# Altium project EVK-NORA-W40.PrjPcb (part 1 of 4)
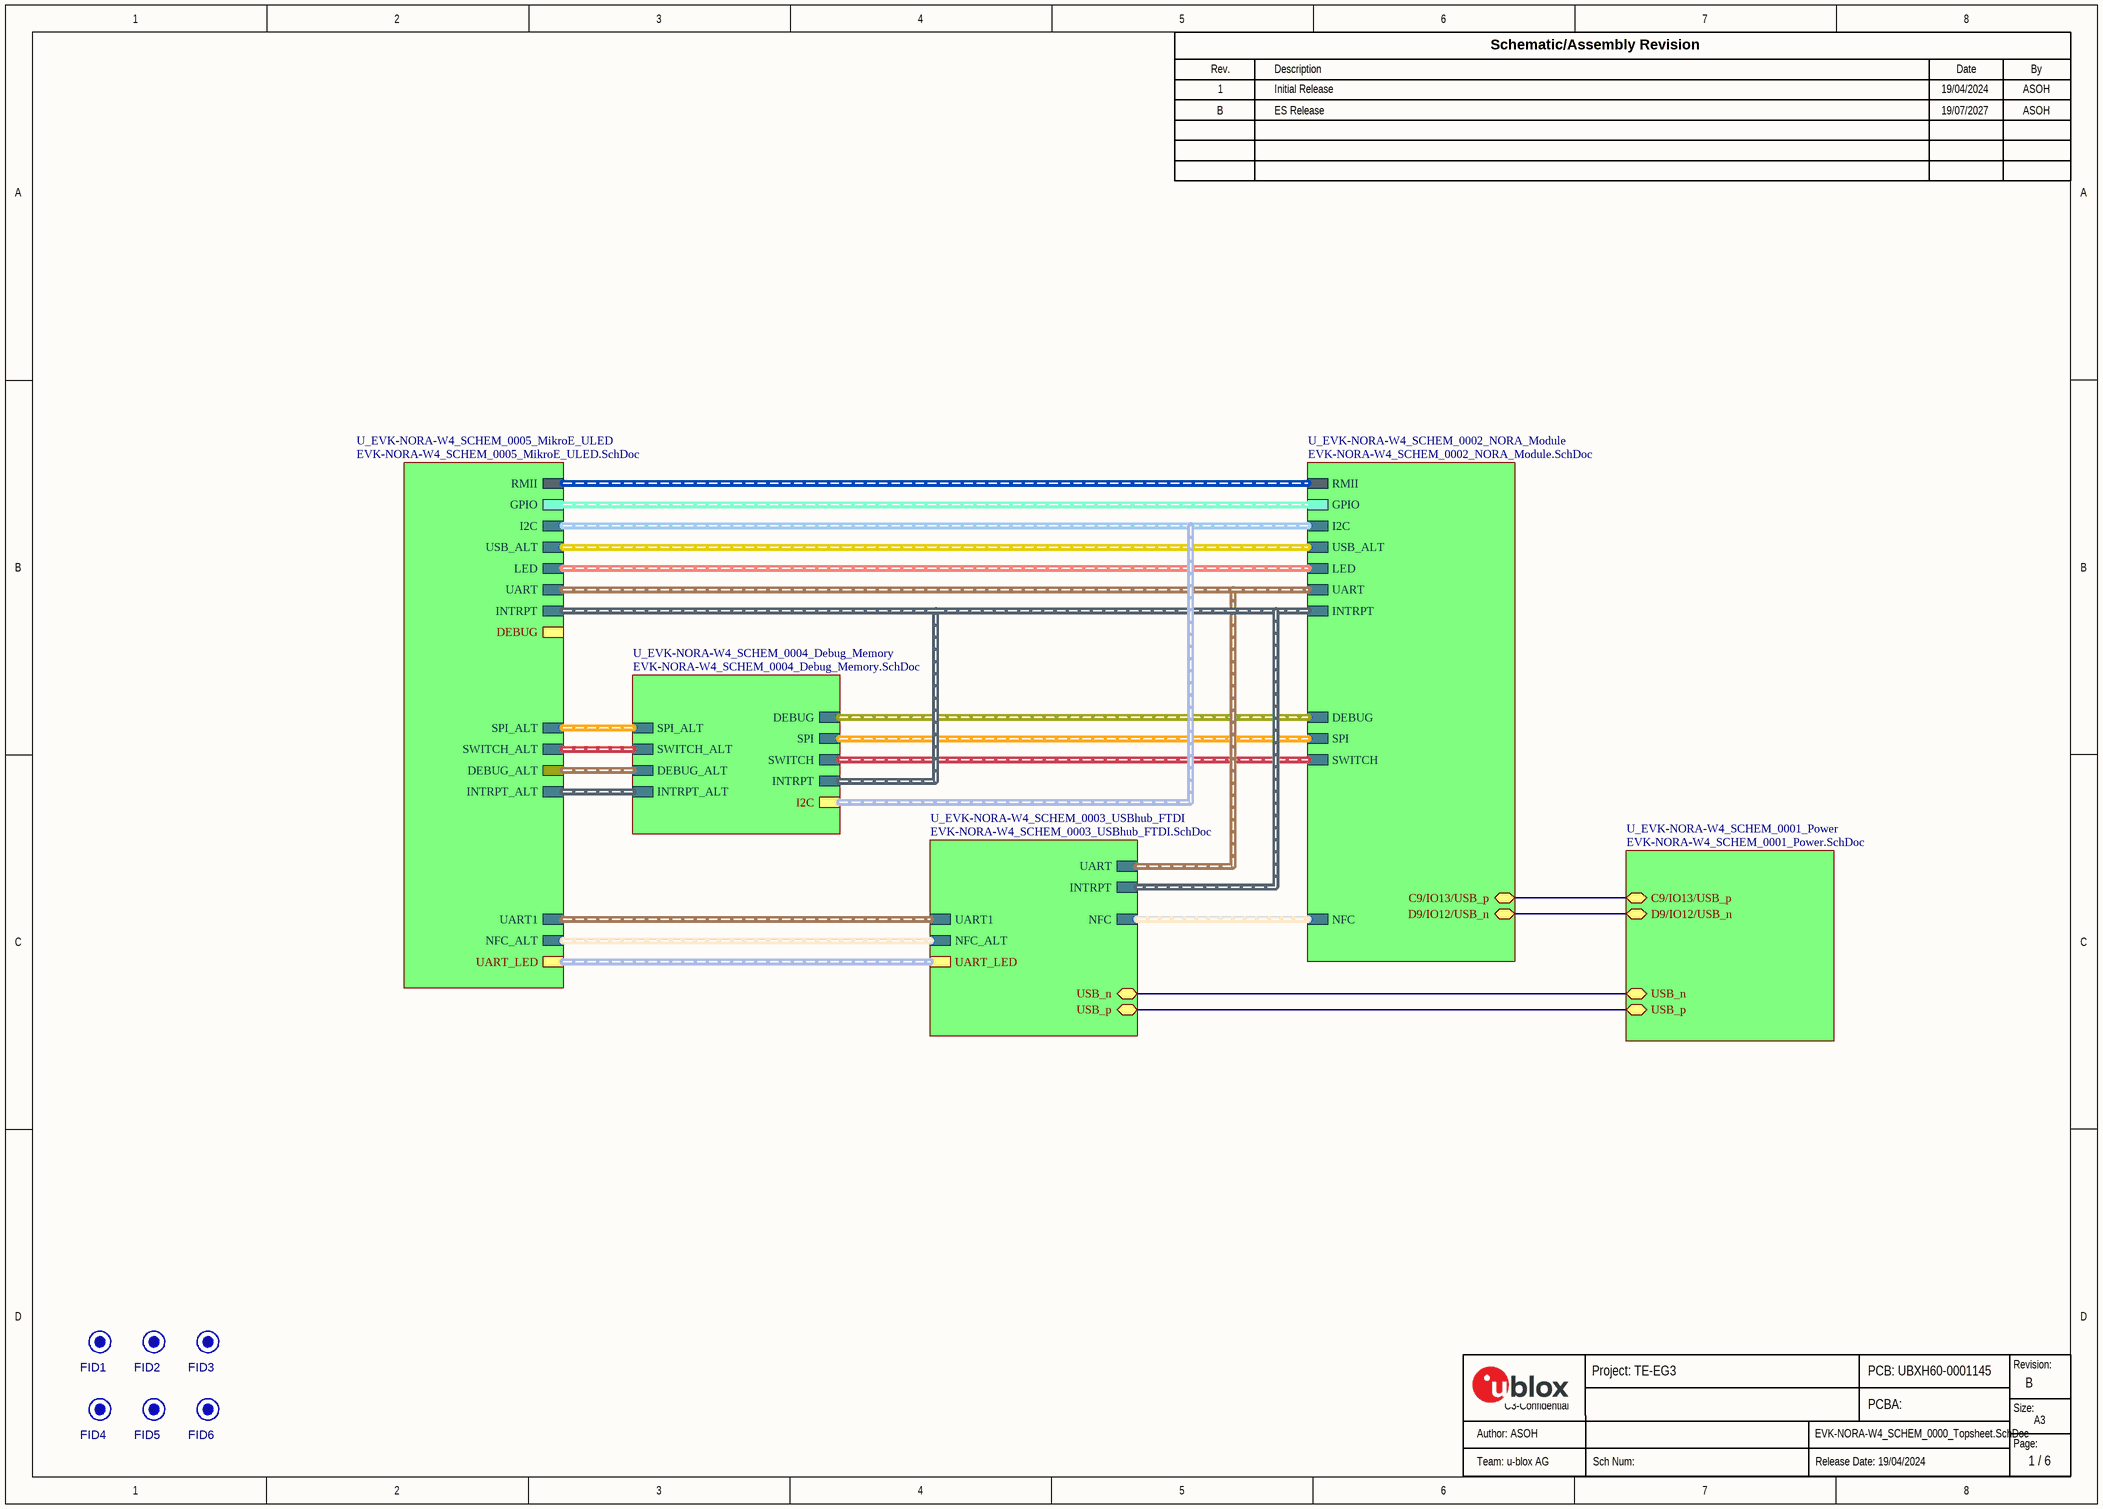
[diagram p0: EVK-NORA-W4_SCHEM_0000_Topsheet.SchDoc]
GlobalClientName: u-blox; GlobalProjectCode: TE_EG3; GlobalProjectLink: www.u-blox.com; GlobalProjectName: TE-EG3; GlobalProjectRevision: Rev B; GlobalProjectTeam: u-blox AG; GlobalReleaseDate: 04/19/2024; PCBConfidentialGrade: C1; PCBDocNum: UBXH60-0001145; PCBName: EVK-NORA-W40; PCBRevReleaseBy1: ASOH; PCBRevReleaseBy2: ASOH; PCBRevReleaseDate1: 04/19/2024; PCBRevReleaseDate2: 07/19/2024; PCBRevReleaseDesc1: Initial Release; PCBRevReleaseDesc2: ES Release; PCBRevReleaseRev1: A; PCBRevReleaseRev2: B; PCBUBXNum: UBXH60-0001145; ProjectEngineer: ASOH; ReleaseBy1: ASOH; ReleaseBy2: ASOH; ReleaseDate1: 04/19/2024; ReleaseDate2: 07/19/2024; ReleaseDesc1: Initial Release; ReleaseDesc2: ES Release; ReleaseRev1: Rev A; ReleaseRev2: Rev B; SchDocNum: EVK-NORA-W40_SCHEM; SchSheetTotal: 6; UbxPcbNum: UBXH60-0001145; VariantBy1: ASOH; VariantBy2: ASOH; VariantDate1: 19/04/2024; VariantDate2: 19/07/2027; VariantDesc1: Initial Release; VariantDesc2: ES Release; VariantReleaseDate: 19/04/2024; VariantRev: B; VariantRev1: 1; VariantRev2: B
6 sheets, 404 parts. Net scope: flat (ports and power ports of the same name join across sheets).
Board file: EVK-NORA-W40.PcbDoc
Sheets:
  EVK-NORA-W4_SCHEM_0000_Topsheet.SchDoc
    U_EVK-NORA-W4_SCHEM_0001_Power = EVK-NORA-W4_SCHEM_0001_Power.SchDoc
    U_EVK-NORA-W4_SCHEM_0002_NORA_Module = EVK-NORA-W4_SCHEM_0002_NORA_Module.SchDoc
    U_EVK-NORA-W4_SCHEM_0003_USBhub_FTDI = EVK-NORA-W4_SCHEM_0003_USBhub_FTDI.SchDoc
    U_EVK-NORA-W4_SCHEM_0004_Debug_Memory = EVK-NORA-W4_SCHEM_0004_Debug_Memory.SchDoc
    U_EVK-NORA-W4_SCHEM_0005_MikroE_ULED = EVK-NORA-W4_SCHEM_0005_MikroE_ULED.SchDoc

## Sheet EVK-NORA-W4_SCHEM_0000_Topsheet.SchDoc
size A3; Date: 04/04/2024; CompanyName: U-Blox; DrawnBy: ASOH; Engineer: ASOH; Organization: U-Blox; SheetNumber: 1; SheetTotal: 6; SheetSize: B; SheetTitle: TopSheet

### Parts
FID1  FID  [FIDUCIAL40]  (value not drawn)  (no BOM)
FID2  FID  [FIDUCIAL40]  (value not drawn)  (no BOM)
FID3  FID  [FIDUCIAL40]  (value not drawn)  (no BOM)
FID4  FID  [FIDUCIAL40]  (value not drawn)  (no BOM)
FID5  FID  [FIDUCIAL40]  (value not drawn)  (no BOM)
FID6  FID  [FIDUCIAL40]  (value not drawn)  (no BOM)

### Sub-sheets
U_EVK-NORA-W4_SCHEM_0001_Power = EVK-NORA-W4_SCHEM_0001_Power.SchDoc: USB_n (bidir), USB_p (bidir), C9/IO13/USB_p (bidir), D9/IO12/USB_n (bidir)
U_EVK-NORA-W4_SCHEM_0002_NORA_Module = EVK-NORA-W4_SCHEM_0002_NORA_Module.SchDoc: LED (harness LED), DEBUG (harness Debug), INTRPT (harness INTRPT), UART (harness UART), SPI (harness SPI), I2C (harness I2C), NFC (harness NFC), SWITCH (harness SWITCH), RMII (harness RMII), GPIO (harness GPIO), USB_ALT (harness USB_ALT), C9/IO13/USB_p (bidir), D9/IO12/USB_n (bidir)
U_EVK-NORA-W4_SCHEM_0003_USBhub_FTDI = EVK-NORA-W4_SCHEM_0003_USBhub_FTDI.SchDoc: INTRPT (harness INTRPT), UART (harness UART), USB_n (bidir), USB_p (bidir), NFC_ALT (harness NFC_ALT), NFC (harness NFC), UART1 (harness UART1), UART_LED (harness UART_LED)
U_EVK-NORA-W4_SCHEM_0004_Debug_Memory = EVK-NORA-W4_SCHEM_0004_Debug_Memory.SchDoc: DEBUG (harness Debug), INTRPT (harness INTRPT), SPI_ALT (harness SPI_ALT), DEBUG_ALT (harness DEBUG_ALT), SWITCH_ALT (harness SWITCH_ALT), INTRPT_ALT (harness INTRPT_ALT), SPI (harness SPI), SWITCH (harness SWITCH), I2C (harness I2C)
U_EVK-NORA-W4_SCHEM_0005_MikroE_ULED = EVK-NORA-W4_SCHEM_0005_MikroE_ULED.SchDoc: INTRPT (harness INTRPT), UART (harness UART), RMII (harness RMII), INTRPT_ALT (harness INTRPT_ALT), DEBUG_ALT (harness DEBUG_ALT), USB_ALT (harness USB_ALT), SWITCH_ALT (harness SWITCH_ALT), I2C (harness I2C), UART1 (harness UART1), GPIO (harness GPIO), SPI_ALT (harness SPI_ALT), LED (harness LED), NFC_ALT (harness NFC_ALT), DEBUG (harness Debug), UART_LED (harness UART_LED)

### Nets
(unnamed): sheet U_EVK-NORA-W4_SCHEM_0001_Power/USB_n, sheet U_EVK-NORA-W4_SCHEM_0003_USBhub_FTDI/USB_n
(unnamed): sheet U_EVK-NORA-W4_SCHEM_0001_Power/USB_p, sheet U_EVK-NORA-W4_SCHEM_0003_USBhub_FTDI/USB_p
(unnamed): sheet U_EVK-NORA-W4_SCHEM_0001_Power/C9/IO13/USB_p, sheet U_EVK-NORA-W4_SCHEM_0002_NORA_Module/C9/IO13/USB_p
(unnamed): sheet U_EVK-NORA-W4_SCHEM_0001_Power/D9/IO12/USB_n, sheet U_EVK-NORA-W4_SCHEM_0002_NORA_Module/D9/IO12/USB_n

### Buses and harness runs
harness sheet U_EVK-NORA-W4_SCHEM_0002_NORA_Module/DEBUG = sheet U_EVK-NORA-W4_SCHEM_0004_Debug_Memory/DEBUG
harness sheet U_EVK-NORA-W4_SCHEM_0002_NORA_Module/GPIO = sheet U_EVK-NORA-W4_SCHEM_0005_MikroE_ULED/GPIO
harness sheet U_EVK-NORA-W4_SCHEM_0002_NORA_Module/I2C = sheet U_EVK-NORA-W4_SCHEM_0004_Debug_Memory/I2C = sheet U_EVK-NORA-W4_SCHEM_0005_MikroE_ULED/I2C
harness sheet U_EVK-NORA-W4_SCHEM_0002_NORA_Module/INTRPT = sheet U_EVK-NORA-W4_SCHEM_0003_USBhub_FTDI/INTRPT = sheet U_EVK-NORA-W4_SCHEM_0004_Debug_Memory/INTRPT = sheet U_EVK-NORA-W4_SCHEM_0005_MikroE_ULED/INTRPT
harness sheet U_EVK-NORA-W4_SCHEM_0002_NORA_Module/LED = sheet U_EVK-NORA-W4_SCHEM_0005_MikroE_ULED/LED
harness sheet U_EVK-NORA-W4_SCHEM_0002_NORA_Module/NFC = sheet U_EVK-NORA-W4_SCHEM_0003_USBhub_FTDI/NFC
harness sheet U_EVK-NORA-W4_SCHEM_0002_NORA_Module/RMII = sheet U_EVK-NORA-W4_SCHEM_0005_MikroE_ULED/RMII
harness sheet U_EVK-NORA-W4_SCHEM_0002_NORA_Module/SPI = sheet U_EVK-NORA-W4_SCHEM_0004_Debug_Memory/SPI
harness sheet U_EVK-NORA-W4_SCHEM_0002_NORA_Module/SWITCH = sheet U_EVK-NORA-W4_SCHEM_0004_Debug_Memory/SWITCH
harness sheet U_EVK-NORA-W4_SCHEM_0002_NORA_Module/UART = sheet U_EVK-NORA-W4_SCHEM_0003_USBhub_FTDI/UART = sheet U_EVK-NORA-W4_SCHEM_0005_MikroE_ULED/UART
harness sheet U_EVK-NORA-W4_SCHEM_0002_NORA_Module/USB_ALT = sheet U_EVK-NORA-W4_SCHEM_0005_MikroE_ULED/USB_ALT
harness sheet U_EVK-NORA-W4_SCHEM_0003_USBhub_FTDI/NFC_ALT = sheet U_EVK-NORA-W4_SCHEM_0005_MikroE_ULED/NFC_ALT
harness sheet U_EVK-NORA-W4_SCHEM_0003_USBhub_FTDI/UART1 = sheet U_EVK-NORA-W4_SCHEM_0005_MikroE_ULED/UART1
harness sheet U_EVK-NORA-W4_SCHEM_0003_USBhub_FTDI/UART_LED = sheet U_EVK-NORA-W4_SCHEM_0005_MikroE_ULED/UART_LED
harness sheet U_EVK-NORA-W4_SCHEM_0004_Debug_Memory/DEBUG_ALT = sheet U_EVK-NORA-W4_SCHEM_0005_MikroE_ULED/DEBUG_ALT
harness sheet U_EVK-NORA-W4_SCHEM_0004_Debug_Memory/INTRPT_ALT = sheet U_EVK-NORA-W4_SCHEM_0005_MikroE_ULED/INTRPT_ALT
harness sheet U_EVK-NORA-W4_SCHEM_0004_Debug_Memory/SPI_ALT = sheet U_EVK-NORA-W4_SCHEM_0005_MikroE_ULED/SPI_ALT
harness sheet U_EVK-NORA-W4_SCHEM_0004_Debug_Memory/SWITCH_ALT = sheet U_EVK-NORA-W4_SCHEM_0005_MikroE_ULED/SWITCH_ALT

### Notes on the sheet
- Rev.
- Description
- Schematic/Assembly Revision
- Date
- By
- Revision:
- C3-Confidential
- Page:
- Size:
- A3

### Library data of the parts
FID1-FID6 = FIDUCIAL.04: Fiducial, 0.040" inner Dia, 0.075" outer Dia; Added By: Jeremy D; Part Number: FIDUCIAL.04; Size: 0.040"; Height: 0; DNP: DNP; Added Date: 2/1/2015; Checked By: Paul B; Checked Date: 2/5/2015

## Sheet EVK-NORA-W4_SCHEM_0001_Power.SchDoc
size A3; Date: 04/04/2024; CompanyName: U-blox; DrawnBy: ASOH; Engineer: ASOH; Organization: U-blox; SheetNumber: 2; SheetTotal: 6; SheetSize: B; SheetTitle: Power
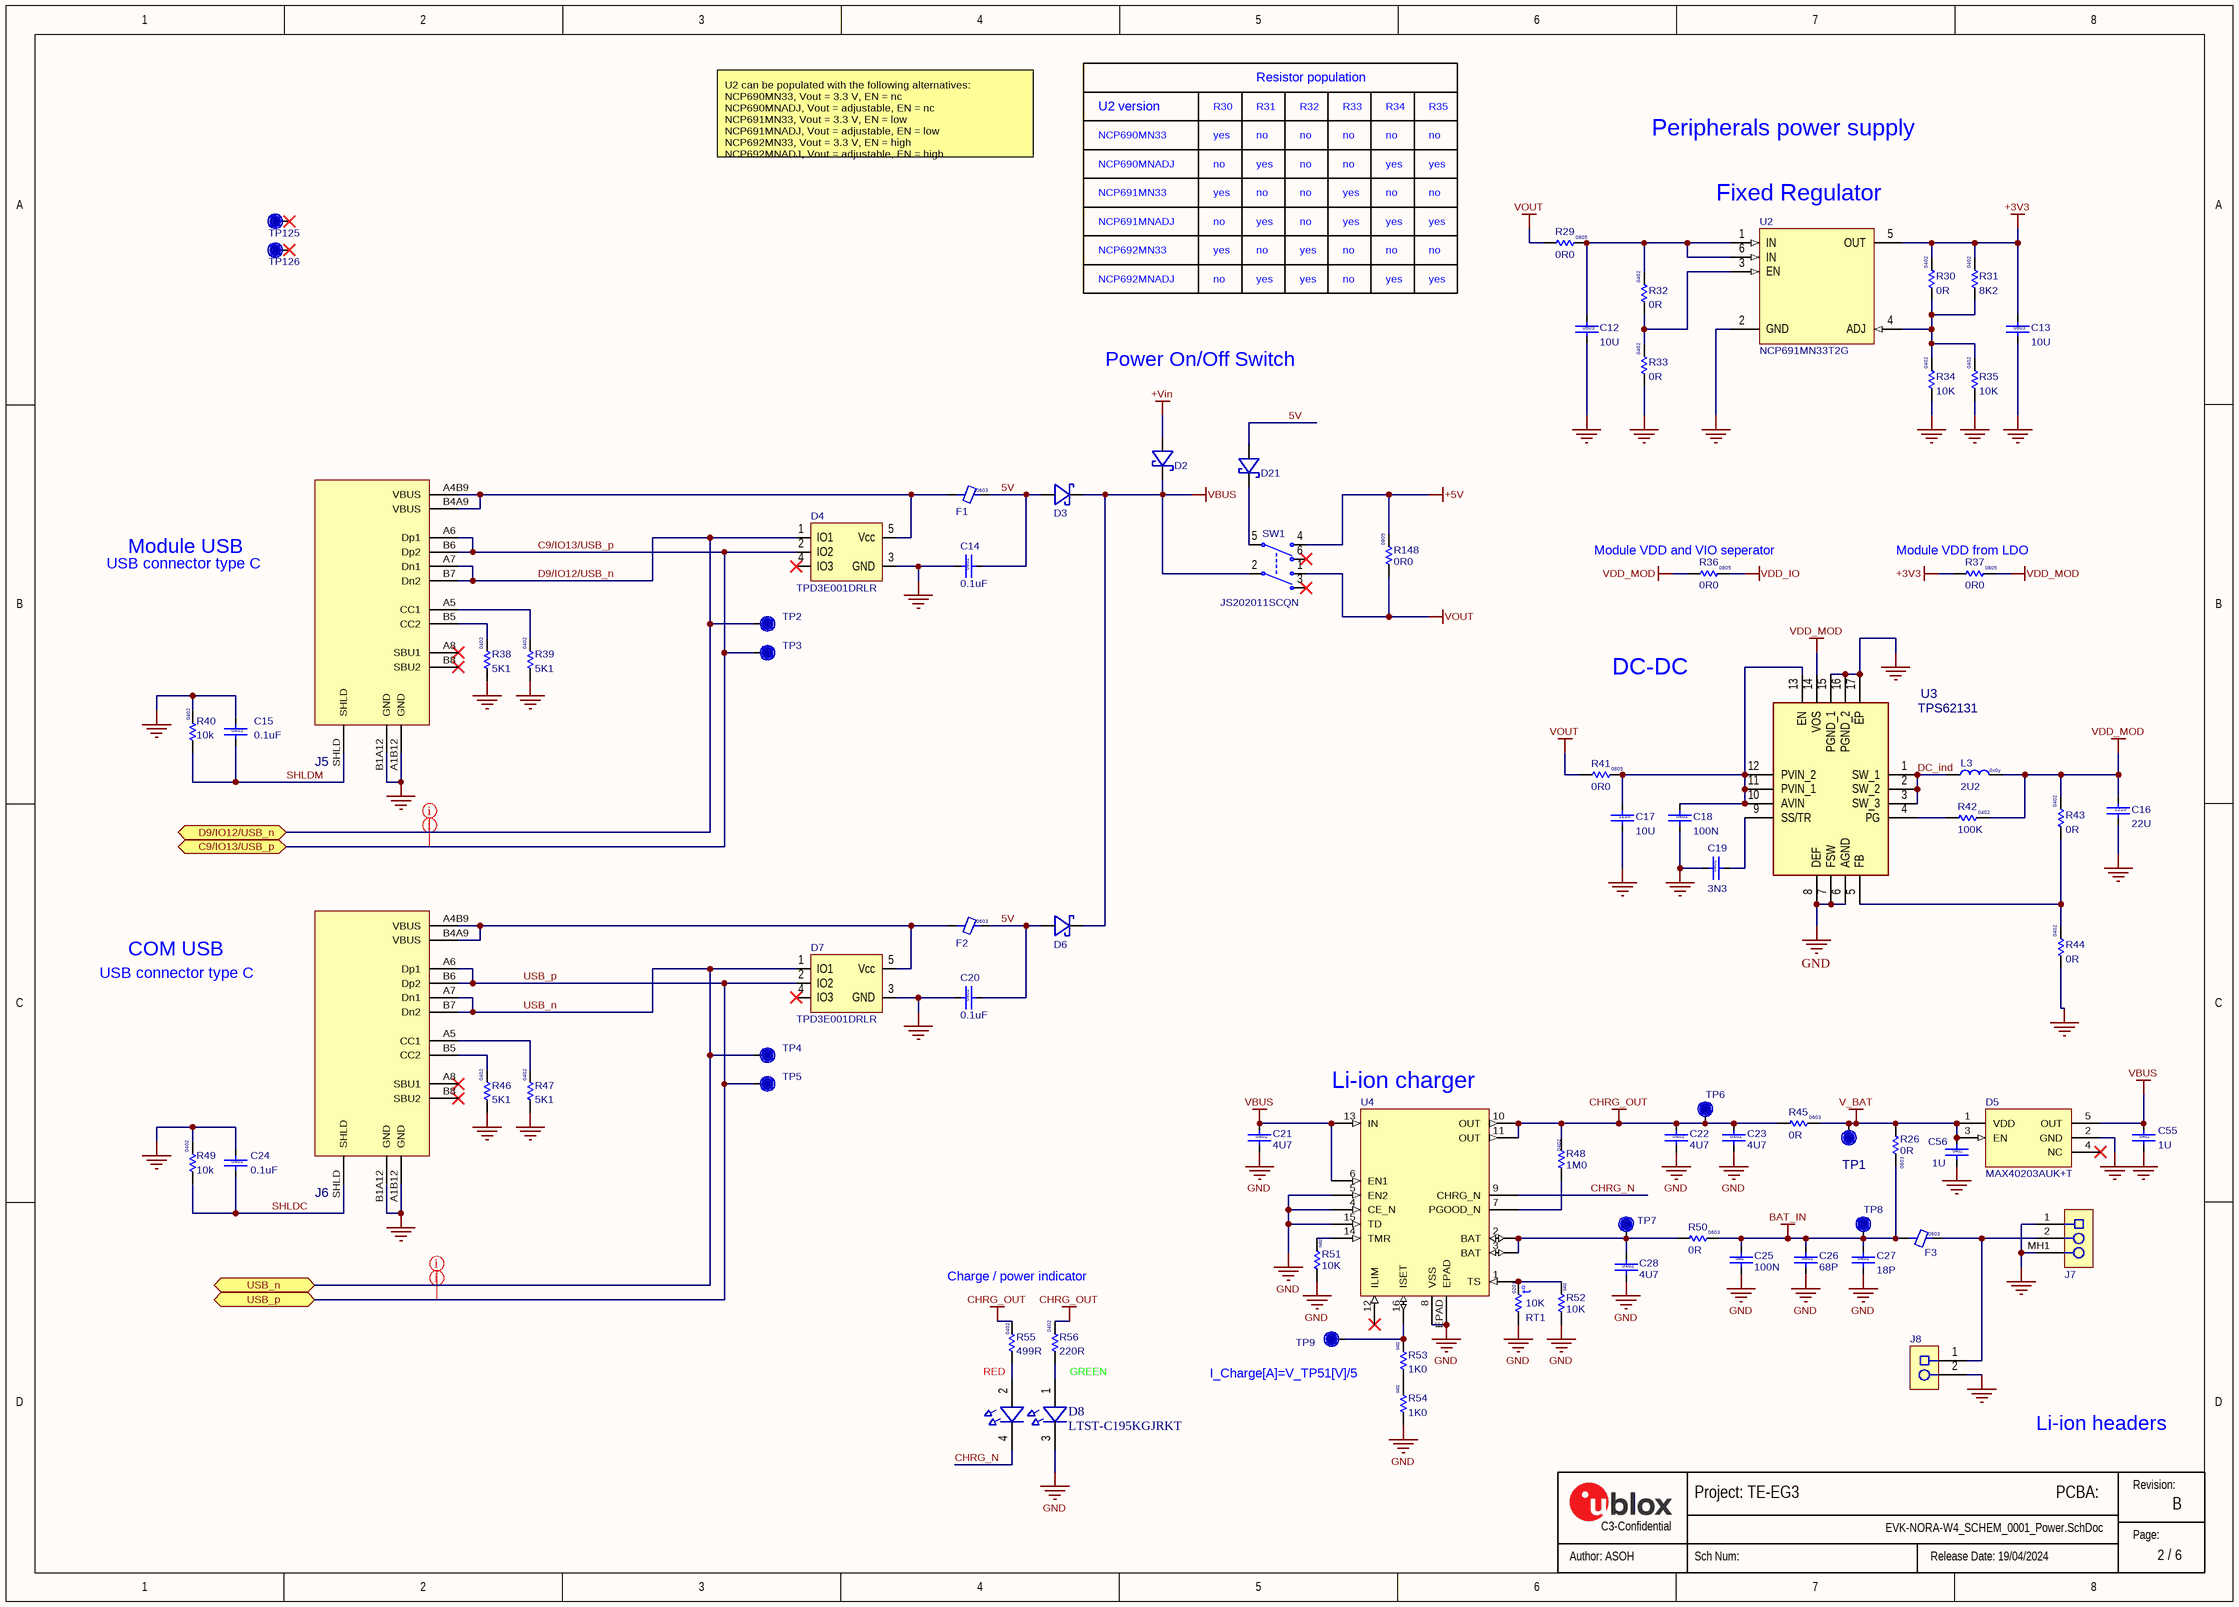
[diagram p1: EVK-NORA-W4_SCHEM_0001_Power.SchDoc]

### Parts
C12  value 10U  Size: 0603  [CAP_0603_1750Lx950Wx850H_600x1000Pad_900G_FLX]
C13  value 10U  Size: 0603  [CAP_0603_1750Lx950Wx850H_600x1000Pad_900G_FLX]
C14  value 0.1uF  Size: 0402  [Cap 0402 HD]  (hidden comment: 120-000160.1uF)
C15  value 0.1uF  Size: 0402  [Cap 0402 HD]  (hidden comment: 120-000160.1uF)
C16  value 22U  Size: 1210  [CAP_1210_3400Lx2700Wx1350H_900x2700Pad_1900G_FLX]
C17  value 10U  Size: 1210  [CAP_1210_3400Lx2700Wx1350H_900x2700Pad_1900G_FLX]
C18  value 100N  Size: 0402  [Cap_0402_1100Lx600Wx600H_600x600Pad_350G_FLX]
C19  value 3N3  Size: 0402  [Cap_0402_1100Lx600Wx600H_600x600Pad_350G_FLX]
C20  value 0.1uF  Size: 0402  [Cap 0402 HD]  (hidden comment: 120-000160.1uF)
C21  value 4U7  Size: 0402  [Cap 0402 HD]
C22  value 4U7  Size: 0402  [Cap 0402 HD]
C23  value 4U7  Size: 0402  [Cap 0402 HD]
C24  value 0.1uF  Size: 0402  [Cap 0402 HD]  (hidden comment: 120-000160.1uF)
C25  value 100N  Size: 0402  [Cap 0402 HD]
C26  value 68P  Size: 0402  [Cap 0402 HD]
C27  value 18P  Size: 0402  [Cap_0402_1100Lx600Wx600H_600x600Pad_350G_FLX]
C28  value 4U7  Size: 0402  [Cap 0402 HD]
C55  value 1U  Size: 0402  [Cap 0402 HD]
C56  value 1U  Size: 0402  [Cap 0402 HD]
D2  (no value)  [SOD-123F_U]
D3  (no value)  [SOD-123F_U]
D4  Manufacturer P/N: TPD3E001DRLR  [SOT-553]  (hidden comment: 110-00018)
D5  Manufacturer Part Number 1: MAX40203AUK+T  [SOT-23-5_2]
D6  (no value)  [SOD-123F_U]
D7  Manufacturer P/N: TPD3E001DRLR  [SOT-553]  (hidden comment: 110-00018)
D8  LTST-C195KGJRKT  [LTSTC195KGJRKT]
D21  (no value)  [SOD-123F_U]
F1  Size: 0603  [IND_0603_1750Lx950Wx1050H_600x800Pad_800G_FLX]
F2  Size: 0603  [IND_0603_1750Lx950Wx1050H_600x800Pad_800G_FLX]
F3  Size: 0603  [IND_0603_1750Lx950Wx1050H_600x800Pad_800G_FLX]
J5  USB4105-GF-A  [USB4105-GF-A]  (value not drawn)
J6  USB4105-GF-A  [USB4105-GF-A]  (value not drawn)
J7  (no value)  [B2B-PH-SM4-TB]
J8  (no value)  [HDR-0.1P-2PIN-TH]
L3  value 2U2  Size: 0x0y  [IND_0603_1800Lx1000Wx1000H_600x1000Pad_650G_FLX]
R26  value 0R  Size: 0603  [RES_0603_1700Lx950Wx600H_600x1000Pad_800G_FLX]
R29  value 0R0  Size: 0805  [RES 0805_2150Lx1400Wx650H_800x1300Pad_1000G_FLX]
R30  value 0R  Size: 0402  [RES 0402 HD]
R31  value 8K2  Size: 0402  [RES_0402_1100Lx600Wx400H_500x600Pad_400G_FLX]
R32  value 0R  Size: 0402  [RES 0402 HD]
R33  value 0R  Size: 0402  [RES 0402 HD]
R34  value 10K  Size: 0402  [RES 0402 HD]
R35  value 10K  Size: 0402  [RES 0402 HD]
R36  value 0R0  Size: 0805  [RES 0805_2150Lx1400Wx650H_800x1300Pad_1000G_FLX]
R37  value 0R0  Size: 0805  [RES 0805_2150Lx1400Wx650H_800x1300Pad_1000G_FLX]
R38  value 5K1  Size: 0402  [RES 0402 HD]
R39  value 5K1  Size: 0402  [RES 0402 HD]
R40  value 10k  Size: 0402  [RES 0402 HD]
R41  value 0R0  Size: 0805  [RES 0805_2150Lx1400Wx650H_800x1300Pad_1000G_FLX]
R42  value 100K  Size: 0402  [RES 0402 HD]
R43  value 0R  Size: 0402  [RES 0402 HD]
R44  value 0R  Size: 0402  [RES 0402 HD]
R45  value 0R  Size: 0603  [RES_0603_1700Lx950Wx600H_600x1000Pad_800G_FLX]
R46  value 5K1  Size: 0402  [RES 0402 HD]
R47  value 5K1  Size: 0402  [RES 0402 HD]
R48  value 1M0  Size: 0402  [RES 0402 HD]
R49  value 10k  Size: 0402  [RES 0402 HD]
R50  value 0R  Size: 0603  [RES_0603_1700Lx950Wx600H_600x1000Pad_800G_FLX]
R51  value 10K  Size: 0402  [RES 0402 HD]
R52  value 10K  Size: 0402  [RES 0402 HD]
R53  value 1K0  Size: 0402  [RES 0402 HD]
R54  value 1K0  Size: 0402  [RES 0402 HD]
R55  value 499R  Size: 0402  [RES 0402 HD]
R56  value 220R  Size: 0402  [RES 0402 HD]
R148  value 0R0  Size: 0805  [RES 0805_2150Lx1400Wx650H_800x1300Pad_1000G_FLX]
RT1  value 10K  Size: 0201  [RES 0201]  (hidden comment: Res Thermal)
SW1  Manufacturer P/N: JS202011SCQN  [SW_Slide_DPDT_JS202011SCQN]
TP1  TP  [TP10R]  (value not drawn)
TP2  TP  [TP10R]  (value not drawn)  (no BOM)
TP3  TP  [TP10R]  (value not drawn)  (no BOM)
TP4  TP  [TP10R]  (value not drawn)  (no BOM)
TP5  TP  [TP10R]  (value not drawn)  (no BOM)
TP6  TP  [TP10R]  (value not drawn)  (no BOM)
TP7  TP  [TP10R]  (value not drawn)  (no BOM)
TP8  TP  [TP10R]  (value not drawn)  (no BOM)
TP9  TP  [TP10R]  (value not drawn)  (no BOM)
TP125  TP  [TP10R]  (value not drawn)  (no BOM)
TP126  TP  [TP10R]  (value not drawn)  (no BOM)
U2  NCP691MN33T2G  [DFN-PSON.1P3X3-7pin_HS-7N]
U3  TPS62131  [QFN50P300X300X100-17N-D]
U4  UBXH05-0000185  [QFN0.5P3x3-16Pin_W-Pad]  (value not drawn)

### Ports
C9/IO13/USB_p (bidir), D9/IO12/USB_n (bidir), USB_n (bidir), USB_p (bidir)

### Nets
+3V3: C13.1 R30.2 R31.2 R37.1 U2.5(OUT)
+5V: R148.2 SW1.4(N.O-2)
+Vin: D2.A(Anode)
BAT_IN: C25.2 C26.1 C27.2 F3.1 R26.2 R50.2 TP8.1
CHRG_OUT: C22.1 C23.1 R45.1 R48.2 R55.2 R56.2 TP6.1 U4.10(OUT) U4.11(OUT)
GND: C12.2 C13.2 C14.1 C15.1 C16.2 C17.2 C18.2 C19.1 C20.1 C21.2 C22.2 C23.2 C24.1 C25.1 C26.2 C27.1 C28.2 C55.2 C56.2 D4.3(GND) D5.2(GND) D7.3(GND) D8.3(K_GREEN_) J5.A1B12(GND) J5.B1A12(GND) J6.A1B12(GND) J6.B1A12(GND) J7.1 J7.MH1 J8.2 R33.1 R34.1 R35.1 R38.1 R39.1 R40.2 R44.1 R46.1 R47.1 R49.2 R51.1 R52.1 R54.1 RT1.2 U2.2(GND) U3.6(AGND) U3.7(FSW) U3.8(DEF) U3.15(PGND_1) U3.16(PGND_2) U3.17(EP) U4.4(CE_N) U4.5(EN2) U4.8(VSS) U4.15(TD) U4.EPAD
V_BAT: C56.1 D5.1(VDD) D5.3(EN) R26.1 R45.2 TP1.1
VBUS: C21.1 C55.1 D2.C(Cathode) D3.C(Cathode) D5.5(OUT) D6.C(Cathode) SW1.2(COM-1) U4.6(EN1) U4.13(IN)
VDD_IO: R36.2
VDD_MOD: C16.1 L3.2 R36.1 R37.2 R42.2 R43.2 U3.14(VOS)
VOUT: R29.1 R41.1 R148.1 SW1.1(N.O-1)
5V: C14.2 C20.2 D3.A(Anode) D6.A(Anode) D21.A(Anode) F1.2 F2.2
C9/IO13/USB_p: D4.2(IO2) J5.A6(Dp1) J5.B6(Dp2) TP3.1 ; port C9/IO13/USB_p
CHRG_N: D8.4(K_RED) U4.9(CHRG_N)
D9/IO12/USB_n: D4.1(IO1) J5.A7(Dn1) J5.B7(Dn2) TP2.1 ; port D9/IO12/USB_n
DC_ind: L3.1 U3.1(SW_1) U3.2(SW_2) U3.3(SW_3)
SHLDC: C24.2 J6.SHLD R49.1
SHLDM: C15.2 J5.SHLD R40.1
USB_n: D7.1(IO1) J6.A7(Dn1) J6.B7(Dn2) TP4.1 ; port USB_n
USB_p: D7.2(IO2) J6.A6(Dp1) J6.B6(Dp2) TP5.1 ; port USB_p
NetC12_1: C12.1 R29.2 R32.2 U2.1(IN) U2.6(IN)
NetC17_1: C17.1 C18.1 R41.2 U3.10(AVIN) U3.11(PVIN_1) U3.12(PVIN_2) U3.13(EN)
NetC19_2: C19.2 U3.9(SS/TR)
NetC28_1: C28.1 R50.1 TP7.1 U4.2(BAT) U4.3(BAT)
NetD4_5: D4.5(Vcc) F1.1 J5.A4B9(VBUS) J5.B4A9(VBUS)
NetD7_5: D7.5(Vcc) F2.1 J6.A4B9(VBUS) J6.B4A9(VBUS)
NetD8_1: D8.1(A_1) R56.1
NetD8_2: D8.2(A_2) R55.1
NetD21_C: D21.C(Cathode) SW1.5(COM-2)
NetF3_2: F3.2 J7.2 J8.1
NetJ5_A5: J5.A5(CC1) R39.2
NetJ5_B5: J5.B5(CC2) R38.2
NetJ6_A5: J6.A5(CC1) R47.2
NetJ6_B5: J6.B5(CC2) R46.2
NetR30_1: R30.1 R31.1 R34.2 R35.2 U2.4(ADJ)
NetR32_1: R32.1 R33.2 U2.3(EN)
NetR42_1: R42.1 U3.4(PG)
NetR43_1: R43.1 R44.2 U3.5(FB)
NetR48_1: R48.1 U4.7(PGOOD_N)
NetR51_2: R51.2 U4.14(TMR)
NetR52_2: R52.2 RT1.1 U4.1(TS)
NetR53_1: R53.1 R54.2
NetR53_2: R53.2 TP9.1 U4.16(ISET)

Not connected (* = marked no-connect by the designer): D4 4(IO3)*; D5 4(NC)*; D7 4(IO3)*; J5 A8(SBU1)* B8(SBU2)*; J6 A8(SBU1)* B8(SBU2)*; SW1 3(N.C-1)* 6(N.C-2)*; TP125 1*; TP126 1*; U4 12(ILIM)*

### Layout directives
net class USB: C9/IO13/USB_p, D9/IO12/USB_n, USB_n, USB_p

### Notes on the sheet
- U2 version
- R30
- R31
- Resistor population
- R32
- R33
- R34
- R35
- U2 can be populated with the following alternatives:
  NCP690MN33, Vout = 3.3 V, EN = nc
  NCP690MNADJ, Vout = adjustable, EN = nc
  NCP691MN33, Vout = 3.3 V, EN = low
  NCP691MNADJ, Vout = adjustable, EN = low
  NCP692MN33, Vout = 3.3 V, EN = high
  NCP692MNADJ, Vout = adjustable, EN = high
- NCP690MN33
- NCP690MNADJ
- NCP691MN33
- yes
- no
- Peripherals power supply
- NCP691MNADJ
- NCP692MN33
- (near U2) Fixed Regulator
- NCP692MNADJ
- Power On/Off Switch
- USB connector type C
- Module USB
- (near R36) Module VDD and VIO seperator
- (near R37) Module VDD from LDO
- DC-DC
- COM USB
- (near U4) Li-ion charger
- Charge / power indicator
- RED
- GREEN
- I_Charge[A]=V_TP51[V]/5
- (near J8) Li-ion headers
- Revision:
- C3-Confidential
- Page:
- (in symbol UBXH18-0000573) t°

### Library data of the parts
C12 C13 = UBXH01-0000310: CAP CER X7R 0603 10U 20% 10V; Manufacturer: Murata Manufacturing Company, Ltd.; Manufacturer P/N: GRM188Z71A106MA73; Editor: michael.hein; Released by: martin.grasse; Env: ROHS; Permitted Use: Volume Products; Perferred: PREF; Mfg P/N Status: Active; Mfg P/N Split: 100; Mfg P/N Released: Yes; Part Number: UBXH01-0000310; Tolerance: 20%; Max Voltage: 10V; Min Operating Temp: -55°C; Max Operating Temp: 125°C; Part Type: Capacitor; Release Data: 2017-02-09T11:14:05; UBX Wiki: https://wiki.u-blox.com/bin/view/Operations/PartDetails?index=26280; RefDes: C; Mfg P/N Datasheet: https://wiki.u-blox.com/bin/view/Generic/Docs/DocumentSummary?index=26282; Manufacturer 2: Murata Manufacturing Company, Ltd.; Manufacturer P/N 2: GRM188Z71A106KA73; Mfg P/N Status 2: Active; Mfg P/N Split 2: 0; Mfg P/N Released 2: Yes; Mfg P/N Datasheet 2: https://wiki.u-blox.com/bin/view/Generic/Docs/DocumentSummary?index=28416
C14 C15 C20 C24 = 120-00016: Cap, Ceramic 0.1uF 10V 10% X5R 0402; Part Name: CAP CER 0.1UF 10V 10% X5R 0402; Part_Type: Ceramic Capacitor; Manufacturer: Murata Electronics North America; Manufacturer P/N: GRM155R61A104KA01J; Item_Phase: Production; Component Mounting Type: SMT; Tolerance: +/- 10%; Use in new designs: Yes; Part Number: 120-00016; Revision: 0A; Supplier 1: Digi-Key; Supplier Part Number 1: 490-6297-1-ND; Manufacturer 2: Yageo; Manufacturer P/N 2: CC0402KRX5R6BB104; Supplier 2: Digi-Key; Supplier Part Number 2: 311-1336-1-ND; Arena Link: https://app.bom.com/a/GYHPV2L2L43KRMBK?v=spec.summary; Height: 0.55mm; Pins: 2; Temperature Coefficient: X5R; Voltage: 10V
C16 = UBXH01-3001005: CAP CER X5R 1210 22U 10% 25V; Manufacturer: Murata Manufacturing Company, Ltd.; Manufacturer P/N: GRM32ER61E226KE15; Editor: roland.rust; Env: ROHS; Permitted Use: Volume Products; Perferred: PREF; Mfg P/N Status: NRND; Mfg P/N Split: 100; Mfg P/N Released: Yes; Part Number: UBXH01-3001005; Tolerance: 10%; Max Voltage: 25V; Part Type: Capacitor; Released by: roland.rust; Release Data: 2009-04-24T15:51:56; UBX Wiki: https://wiki.u-blox.com/bin/view/Operations/PartDetails?index=5780; RefDes: C
C17 = UBXH01-3001004: CAP CER X5R 1210 10U 10% 25V; Manufacturer: Murata Manufacturing Company, Ltd.; Manufacturer P/N: GRM32DR61E106KA12; Editor: andreas.thiel; Released by: johann.furrer; Env: ROHS; Permitted Use: Volume Products; Perferred: NONPREF; Mfg P/N Status: NRND; Mfg P/N Split: 100; Mfg P/N Released: Yes; Part Number: UBXH01-3001004; Tolerance: 10%; Max Voltage: 25V; Part Type: Capacitor; Release Data: 2010-04-01T16:00:35; UBX Wiki: https://wiki.u-blox.com/bin/view/Operations/PartDetails?index=5778; RefDes: C; Mfg P/N Datasheet: https://wiki.u-blox.com/bin/view/Generic/Docs/DocumentSummary?index=8644
C18 = UBXH01-0000204: CAP CER X5R 0402 100N 10% 50V; Manufacturer: Murata Manufacturing Company, Ltd.; Manufacturer P/N: GRM155R61H104KE14D; Editor: matej.budin; Released by: erian.bezhani; Env: ROHS; Permitted Use: Support Products; Perferred: PREF; Mfg P/N Status: Active; Mfg P/N Split: 100; Mfg P/N Released: Yes; Part Number: UBXH01-0000204; Tolerance: 10%; Max Voltage: 50V; Part Type: Capacitor; Release Data: 2015-08-06T11:12:34; UBX Wiki: https://wiki.u-blox.com/bin/view/Operations/PartDetails?index=22967; RefDes: C; Mfg P/N Datasheet: https://wiki.u-blox.com/bin/view/Generic/Docs/DocumentSummary?index=22969
C19 = UBXH01-0023019: CAP CER X7R 0402 3N3 10% 16V; Manufacturer: Murata Manufacturing Company, Ltd.; Manufacturer P/N: GRM155R71H332KA01; Editor: dario.antonaz; Released by: pierpaolo.arban; Env: ROHS; Permitted Use: Volume Products; Perferred: PREF; Mfg P/N Status: NRND; Mfg P/N Split: 100; Mfg P/N Released: Yes; Part Number: UBXH01-0023019; Tolerance: 10%; Max Voltage: 16V; Part Type: Capacitor; Release Data: 2013-08-21T12:21:41; UBX Wiki: https://wiki.u-blox.com/bin/view/Operations/PartDetails?index=5479; RefDes: C; Mfg P/N Datasheet: https://wiki.u-blox.com/bin/view/Generic/Docs/DocumentSummary?index=19430
C21-C23 C28 = UBXH01-0000243: CAP CER X5R 0402 4U7 20% 10V; Manufacturer: Murata Manufacturing Company, Ltd.; Manufacturer P/N: GRM155R61A475MEAA; Editor: martin.pilik; Released by: fabrice.bret-dibat; Env: GREEN; Permitted Use: Volume Products; Perferred: PREF; Mfg P/N Status: Active; Mfg P/N Split: 100; Mfg P/N Released: Yes; Part Number: UBXH01-0000243; Tolerance: 20%; Max Voltage: 10V; Min Operating Temp: -40°C; Max Operating Temp: 85°C; Part Type: Capacitor; Release Data: 2021-05-10T12:57:47; UBX Wiki: https://wiki.u-blox.com/bin/view/Operations/PartDetails?index=24303; RefDes: C; Mfg P/N Datasheet: https://wiki.u-blox.com/bin/view/Generic/Docs/DocumentSummary?index=24302
C25 = UBXH01-2021002: CAP CER X5R 0402 100N 10% 10V; Manufacturer: Murata Manufacturing Company, Ltd.; Manufacturer P/N: GRM155R61A104KA01; Editor: roland.rust; Env: GREEN; Permitted Use: Volume Products; Perferred: PREF; Mfg P/N Status: NRND; Mfg P/N Split: 100; Mfg P/N Released: Yes; Part Number: UBXH01-2021002; Tolerance: 10%; Max Voltage: 10V; Part Type: Capacitor; Released by: roland.rust; Release Data: 2005-07-22T13:59:44; UBX Wiki: https://wiki.u-blox.com/bin/view/Operations/PartDetails?index=5759; RefDes: C; Manufacturer 2: Samsung Electro-Mechanics; Manufacturer P/N 2: CL05A104KP5NNN; Mfg P/N Status 2: Active; Mfg P/N Split 2: 0; Mfg P/N Released 2: Yes; Mfg P/N Datasheet 2: https://wiki.u-blox.com/bin/view/Generic/Docs/DocumentSummary?index=28113
C26 = UBXH01-0004024: CAP CER C0G 0402 68P 5% 25V; Manufacturer: Murata Manufacturing Company, Ltd.; Manufacturer P/N: GRM1555C1H680JA01; Editor: martin.frauchiger; Env: ROHS; Permitted Use: Volume Products; Perferred: PREF; Mfg P/N Status: NRND; Mfg P/N Split: 100; Mfg P/N Released: Yes; Part Number: UBXH01-0004024; Tolerance: 5%; Max Voltage: 25V; Part Type: Capacitor; Released by: martin.frauchiger; Release Data: 2005-09-01T15:36:53; UBX Wiki: https://wiki.u-blox.com/bin/view/Operations/PartDetails?index=5199; RefDes: C; Mfg P/N Datasheet: https://wiki.u-blox.com/bin/view/Generic/Docs/DocumentSummary?index=19268; Manufacturer 2: Murata Manufacturing Company, Ltd.; Manufacturer P/N 2: GRM1555C1E680F; Mfg P/N Status 2: NRND; Mfg P/N Split 2: 0; Mfg P/N Released 2: Yes; Manufacturer 3: Murata Manufacturing Company, Ltd.; Manufacturer P/N 3: GRM1555C1H680F; Mfg P/N Status 3: NRND; Mfg P/N Split 3: 0; Mfg P/N Released 3: Yes
C27 = UBXH01-0004017: CAP CER C0G 0402 18P 5% 25V; Manufacturer: Murata Manufacturing Company, Ltd.; Manufacturer P/N: GRM1555C1H180JA01; Editor: doris.zahnd; Released by: daniel.hurni; Env: ROHS; Permitted Use: Volume Products; Perferred: PREF; Mfg P/N Status: NRND; Mfg P/N Split: 100; Mfg P/N Released: Yes; Part Number: UBXH01-0004017; Tolerance: 5%; Max Voltage: 25V; Min Operating Temp: -55°C; Max Operating Temp: 125°C; Part Type: Capacitor; Release Data: 2009-12-03T17:48:42; UBX Wiki: https://wiki.u-blox.com/bin/view/Operations/PartDetails?index=5178; RefDes: C; Manufacturer 2: Murata Manufacturing Company, Ltd.; Manufacturer P/N 2: GRM1555C1E180JZ01; Mfg P/N Status 2: Obsolete; Mfg P/N Split 2: 0; Mfg P/N Released 2: Yes; Manufacturer 3: Murata Manufacturing Company, Ltd.; Manufacturer P/N 3: GRM1555C1H180JZ01; Mfg P/N Status 3: Obsolete; Mfg P/N Split 3: 0; Mfg P/N Released 3: Yes
C55 C56 = UBXH01-0000248: CAP CER X5R 0402 1U 10% 10V; Manufacturer: Murata Manufacturing Company, Ltd.; Manufacturer P/N: GRM155R61C105KA12; Editor: michael.hein; Released by: igor.shevchenko; Env: ROHS; Permitted Use: Volume Products; Perferred: PREF; Mfg P/N Status: Active; Mfg P/N Split: 100; Mfg P/N Released: Yes; Part Number: UBXH01-0000248; Tolerance: 10%; Max Voltage: 10V; Min Operating Temp: -40°C; Max Operating Temp: 85°C; Part Type: Capacitor; Release Data: 2016-03-16T11:26:35; UBX Wiki: https://wiki.u-blox.com/bin/view/Operations/PartDetails?index=24378; RefDes: C; Mfg P/N Datasheet: https://wiki.u-blox.com/bin/view/Generic/Docs/DocumentSummary?index=29581; Manufacturer 2: TDK Corporation; Manufacturer P/N 2: C1005X5R1E105K050BC; Mfg P/N Status 2: Active; Mfg P/N Split 2: 0; Mfg P/N Released 2: Yes; Mfg P/N Datasheet 2: https://wiki.u-blox.com/bin/view/Generic/Docs/DocumentSummary?index=28058; Manufacturer 3: Samsung Electro-Mechanics; Manufacturer P/N 3: CL05A105KA5NQNC; Mfg P/N Status 3: Active; Mfg P/N Split 3: 0; Mfg P/N Released 3: Yes; Mfg P/N Datasheet 3: https://wiki.u-blox.com/bin/view/Generic/Docs/DocumentSummary?index=28056
D2 D3 D6 D21 = 110-00005: Diode, Schottky, 20V 1A SOD-123F, 340mV Vf @ 1A / MBR120VLSFT3G; Manufacturer 1: ON Semiconductor; Part Name: Diode Schottky 20V 1A SOD-123FL; Body Size: None; Item Phase: In Production; MFG Package: SOD-123FL; Use in new designs: Yes; Part Number: 110-00005; Manufacturer Part Number 1: MBR120VLSFT3G; Supplier 1: Digi-Key; Supplier Part Number 1: MBR120VLSFT3GOSCT-ND; Manufacturer 2: None; Manufacturer Part Number 2: None; Supplier 2: None; Supplier Part Number 2: None; Current: 1A; Height: 0.98mm; Max Operating Temp: 125; Min Operating Temp: -65; Pins: 2; Revision: 0B; Voltage: 20V; UBX Code: None
D4 D7 = 110-00018: LOW-CAPACITANCE 3-CHANNEL ESD-PROTECTION ARRAY; Part Name: TVS Diode, 3CH High Speed ESD; Part_Type: Diode; Manufacturer: Texas Instruments; Item_Phase: Production; Body Size: 1.6mm x 1.2mm; Component Mounting Type: SMT; Diode Type: TVS; Use in new designs: Yes; Voltage: 5V; Part Number: 110-00018; Revision: 0A; Supplier 1: Digi-Key; Supplier Part Number 1: 296-21885-1-ND; Arena Link: https://app.bom.com/a/UCV39GZGZIHX50AE?v=spec.summary; Height: .55mm; MFG Package: SOT-553; Package Type: SOT; Pins: 5
D5 = UBXH12-0000539: IDEAL DIODE OR CONTROLLER SOURCE SELECTOR SWITCH P-CHANNEL 1:1 SOT-23-5 5.5V 1A; Part Name: IC IDEAL DIODE LDO 1.2-5.5V 1.0A SOT-23-5; Manufacturer 1: Maxim; Item_Phase: Preliminary; Body Size: 2.8mm x 2.9mm; Component Mounting Type: SMT; Current: 1.0A; SMT Pitch: 0.95mm; Use in new designs: Yes; Value: MAX40203AUK+T; Editor: eric.moog; Env: ROHS; Permitted Use: Support Products; Mfg P/N Status: Active; Mfg P/N Split: 100; Mfg P/N Released: No; Part Number: UBXH12-0000539; Part_Type: Ideal Diode; Supplier 1: Digi-Key; Supplier Part Number 1: 175-MAX40203AUK+TTR-ND; Height: 1.25; MFG Package: SOT-23-5; Package Type: SOT-23-5; Pins: 5; Voltage: 5.5V; HelpURL: https://datasheets.maximintegrated.com/en/ds/MAX40203.pdf; Max Voltage: 5.5V; Max Current: 1A; Part Type: PMIC; UBX Wiki: https://wiki.u-blox.com/bin/view/Operations/PartDetails?index=38597; Perferred: N/A; RefDes: U; Manufacturer: Maxim; Manufacturer P/N: MAX40203AUK+T; Mfg P/N Datasheet: https://wiki.u-blox.com/bin/view/Generic/Docs/DocumentSummary?index=38598
D8 = LTST-C195KGJRKT: LED; Manufacturer_Name: Lite-On; Datasheet Link: https://mm.digikey.com/Volume0/opasdata/d220001/medias/docus/1134/LTST-C195KGJRKT.pdf; Height: 0.65mm; Manufacturer_Part_Number: LTST-C195KGJRKT; Mouser Part Number: 859-LTST-C195KGJRKT; Mouser Price/Stock: https://www.mouser.co.uk/ProductDetail/Lite-On/LTST-C195KGJRKT?qs=ohURClPaJWCkP7ius%252BRMYA%3D%3D; Arrow Part Number: LTST-C195KGJRKT; Arrow Price/Stock: https://www.arrow.com/en/products/ltst-c195kgjrkt/lite-on-technology?region=nac
F1-F3 = UBXH08-0000001: FERRITE BEAD 0603 600 OHM AT 100MHZ 600OHM 500mA; Manufacturer: TDK Corporation; Manufacturer P/N: MMZ1608B601C; Editor: daniel.hurni; Released by: martin.frauchiger; Env: ROHS; Permitted Use: Support Products; Perferred: PREF; Mfg P/N Status: Active; Mfg P/N Split: 100; Mfg P/N Released: Yes; Part Number: UBXH08-0000001; Value: 600OHM; Max Current: 500mA; Min Operating Temp: -40°C; Max Operating Temp: 125°C; Part Type: Ferrite; Release Data: 2009-12-02T10:18:36; UBX Wiki: https://wiki.u-blox.com/bin/view/Operations/PartDetails?index=7960; RefDes: FB; Mfg P/N Datasheet: https://wiki.u-blox.com/bin/view/Generic/Docs/DocumentSummary?index=7941
J5 J6 = UBXH04-0000785: CONN RCP USB2.0 TYP C 24P SMD RA 20V 6.25A; Manufacturer 1: GCT; Body Size: 7.3mm x 8.9mm; Item Phase: Unreleased; SMT Pitch: 0.5mm; Use in new designs: Yes; Voltage: <20V DC; UBX Code: None; Editor: eric.moog; Env: ROHS; Permitted Use: Support Products; Perferred: PREF; Mfg P/N Status: Active; Mfg P/N Split: 100; Mfg P/N Released: No; Part Number: UBXH04-0000785; Manufacturer Part Number 1: USB4105-GF-A; Height: 3.31mm; Max Operating Temp: 85°C; Min Operating Temp: -40°C; Pins: 8; Revision: None; Size: Other; Manufacturer 2: None; Manufacturer Part Number 2: None; Supplier 2: None; Supplier Part Number 2: None; Value: USB4105-GF-A; Max Voltage: 20V; Max Current: 6.25A; Part Type: Connector; UBX Wiki: https://wiki.u-blox.com/bin/view/Operations/PartDetails?index=38207; RefDes: J; Manufacturer: GCT; Manufacturer P/N: USB4105-GF-A; Mfg P/N Datasheet: https://wiki.u-blox.com/bin/view/Generic/Docs/DocumentSummary?index=38208
J7 = UBXH04-0000791: CONN 1-ROW SMT 2.0MM GRID 2-PIN VERT 100V 2A; Part Name: Conn, SMT, 0.079" Pitch, 2 Pin, Vert, Black; Manufacturer: JST; Item Phase: In Production; Use in new designs: Yes; Voltage: None; Value: B2B-PH-SM4-TB; Editor: eric.moog; Env: ROHS; Permitted Use: Support Products; Mfg P/N Status: Active; Mfg P/N Split: 100; Mfg P/N Released: No; Part Number: UBXH04-0000791; Manufacturer Part Number 1: B2B-PH-SM4-TB; Supplier 1: None; Supplier Part Number 1: None; Diameter: None; Height: 6.5mm; Max Operating Temp: 85°C; Min Operating Temp: -30°C; Pins: 2; Revision: 0A; UBX Code: None; Manufacturer 2: None; Manufacturer Part Number 2: None; Supplier 2: None; Supplier Part Number 2: None; Manufacturer P/N: B2B-PH-SM4-TB; Max Voltage: 100V; Max Current: 2A; Part Type: Connector; UBX Wiki: https://wiki.u-blox.com/bin/view/Operations/PartDetails?index=38567; Perferred: N/A; RefDes: J; Mfg P/N Datasheet: https://wiki.u-blox.com/bin/view/Generic/Docs/DocumentSummary?index=35463
J8 = UBXH04-0000026: 1-ROW TH-PCB SOCKETS 100MIL GRID 2-PIN 0.64MM SQUARE POLARIZE; Manufacturer P/N: M20-9990245; Manufacturer: HARWiN; Value: M20-9990245; Editor: roland.rust; Released by: alvaro.nussbaum; Env: ROHS; Permitted Use: Internal Use; Perferred: PREF; Mfg P/N Status: Active; Mfg P/N Split: 100; Mfg P/N Released: Yes; Part Number: UBXH04-0000026; Part Type: Connector; Release Data: 2015-06-04T16:45:09; UBX Wiki: https://wiki.u-blox.com/bin/view/Operations/PartDetails?index=10937; RefDes: J
L3 = UBXH09-0000330: IND TAIYOYUDEN MCHK1608T 2U2 20% 1.5A; Manufacturer: Taiyo Yuden Company, Ltd.; Manufacturer P/N: MCHK1608T2R2MKN; Editor: martin.grasse; Released by: igor.shevchenko; Env: ROHS; Permitted Use: Volume Products; Perferred: PREF; Mfg P/N Status: Active; Mfg P/N Split: 100; Mfg P/N Released: Yes; Part Number: UBXH09-0000330; Tolerance: 20%; Max Current: 1.5A; Min Operating Temp: -40°C; Max Operating Temp: 125°C; Part Type: Inductor; Release Data: 2021-01-25T16:52:34; UBX Wiki: https://wiki.u-blox.com/bin/view/Operations/PartDetails?index=32938; RefDes: L; Mfg P/N Datasheet: https://wiki.u-blox.com/bin/view/Generic/Docs/DocumentSummary?index=32940; Manufacturer 2: Taiyo Yuden Company, Ltd.; Manufacturer P/N 2: LSCNB1608HKT2R2MD; Mfg P/N Status 2: Active; Mfg P/N Split 2: 0; Mfg P/N Released 2: Yes; Mfg P/N Datasheet 2: https://wiki.u-blox.com/bin/view/Generic/Docs/DocumentSummary?index=39018; Manufacturer 3: Taiyo Yuden Company, Ltd.; Manufacturer P/N 3: LLCNB1608HKT2R2MD; Mfg P/N Status 3: Active; Mfg P/N Split 3: 0; Mfg P/N Released 3: Yes; Mfg P/N Datasheet 3: https://wiki.u-blox.com/bin/view/Generic/Docs/DocumentSummary?index=39017
R26 R45 R50 = UBXH18-0003001: RES THICK FILM CHIP 0603 0R 0 100mW; Manufacturer: YAGEO; Manufacturer P/N: RC0603JR-070RL; Tolerance: 0; Editor: martin.frauchiger; Env: ROHS; Permitted Use: Volume Products; Perferred: PREF; Mfg P/N Status: Active; Mfg P/N Split: 100; Mfg P/N Released: Yes; Part Number: UBXH18-0003001; Max Power: 100mW; Part Type: Resistor; Released by: martin.frauchiger; Release Data: 2005-07-14T10:55:51; UBX Wiki: https://wiki.u-blox.com/bin/view/Operations/PartDetails?index=6609; RefDes: R
R29 R36 R37 R41 R148 = UBXH18-0000000: RES THICK FILM CHIP 0805 0R015 1% 330mW; Manufacturer: KOA Speer Electronics, Inc.; Manufacturer P/N: RK73Z2ATTDD; Editor: roland.rust; Released by: frank.felbier; Env: ROHS; Permitted Use: Internal Use; Perferred: PREF; Mfg P/N Status: Active; Mfg P/N Split: 100; Mfg P/N Released: No; Tolerance: 1%; Max Power: 330mW; Min Operating Temp: -40°C; Max Operating Temp: 155°C; Part Type: Resistor; Release Data: 2009-12-08T13:02:51; RefDes: R
R30 R32 R43 R44 = UBXH18-0003002: RES THICK FILM CHIP 0402 0R 0 100mW; Manufacturer: KOA; Manufacturer P/N: RK73Z1ETTP; Tolerance: 0; Editor: charlotte.biber; Released by: peter.mueller; Env: ROHS; Permitted Use: Volume Products; Perferred: PREF; Mfg P/N Status: NRND; Mfg P/N Split: 100; Mfg P/N Released: Yes; Part Number: UBXH18-0003002; Max Power: 100mW; Part Type: Resistor; Release Data: 2012-06-05 09:49:55.978616; UBX Wiki: https://wiki.u-blox.com/bin/view/Operations/PartDetails?index=6611; RefDes: R; Manufacturer 2: YAGEO; Manufacturer P/N 2: 2322_705_91001_L; Mfg P/N Status 2: NRND; Mfg P/N Split 2: 0; Mfg P/N Released 2: Yes
R31 = UBXH18-0000138: RES THICK FILM CHIP 0402 8K2 1% 63mW; Manufacturer: Vishay; Manufacturer P/N: CRCW04028K20FKED; Editor: matej.budin; Released by: pasquale.scorca; Env: ROHS; Permitted Use: Support Products; Perferred: PREF; Mfg P/N Status: Active; Mfg P/N Split: 100; Mfg P/N Released: Yes; Part Number: UBXH18-0000138; Tolerance: 1%; Max Power: 63mW; Min Operating Temp: -55°C; Max Operating Temp: 125°C; Part Type: Resistor; Release Data: 2014-08-26T11:33:33; UBX Wiki: https://wiki.u-blox.com/bin/view/Operations/PartDetails?index=21078; RefDes: R; Mfg P/N Datasheet: https://wiki.u-blox.com/bin/view/Generic/Docs/DocumentSummary?index=21077
R33 = UBXH18-0003002: RES THICK FILM CHIP 0402 0R 0 100mW; Manufacturer: KOA; Manufacturer P/N: RK73Z1ETTD; Tolerance: 0; Editor: charlotte.biber; Released by: peter.mueller; Env: ROHS; Permitted Use: Volume Products; Perferred: PREF; Mfg P/N Status: NRND; Mfg P/N Split: 100; Mfg P/N Released: Yes; Part Number: UBXH18-0003002; Max Power: 100mW; Part Type: Resistor; Release Data: 2012-06-05T09:49:55; UBX Wiki: https://wiki.u-blox.com/bin/view/Operations/PartDetails?index=6611; RefDes: R; Manufacturer 2: YAGEO; Manufacturer P/N 2: 2322_705_91001_L; Mfg P/N Status 2: Obsolete; Mfg P/N Split 2: 0; Mfg P/N Released 2: Yes
R34 R35 R51 R52 = UBXH18-0000065: RES THICK FILM CHIP 0402 10K 1% 63mW; Manufacturer: KOA; Manufacturer P/N: RK73H1ETTP1002F; Editor: erian.bezhani; Released by: massimo.vlacci; Env: ROHS; Permitted Use: Volume Products; Perferred: PREF; Mfg P/N Status: Active; Mfg P/N Split: 100; Mfg P/N Released: Yes; Part Number: UBXH18-0000065; Tolerance: 1%; Max Power: 63mW; Part Type: Resistor; UBX Wiki: https://wiki.u-blox.com/bin/view/Operations/PartDetails?index=16837; RefDes: R; Mfg P/N Datasheet: https://wiki.u-blox.com/bin/view/Generic/Docs/DocumentSummary?index=8222
  R34 R35: Release Data: 2012-06-08 18:02:21.521517
  R51 R52: Release Data: 2012-06-08T18:02:21
R38 R39 R46 R47 = UBXH18-0008066: RES THICK FILM CHIP 0402 5K1 5% 100mW; Manufacturer: Panasonic; Manufacturer P/N: ERJ-2GEJ512X; Editor: alvaro.nussbaum; Released by: roland.rust; Env: ROHS; Permitted Use: Internal Use; Perferred: NONPREF; Mfg P/N Status: Active; Mfg P/N Split: 100; Mfg P/N Released: No; Part Number: UBXH18-0008066; Tolerance: 5%; Max Power: 100mW; Part Type: Resistor; Release Data: 2016-02-11T15:22:01; UBX Wiki: https://wiki.u-blox.com/bin/view/Operations/PartDetails?index=6972; RefDes: R
R40 R49 = 180-00024: Resistor 10k ohm 1% 1/16W, 0402; Part Name: RES SMD 10K OHM 1% 1/16W 0402; Manufacturer 1: Samsung Electro-Mechanics America, Inc; Manufacturer Part Number 1: RC1005F103CS; Tolerance: +/- 1%; Use in new designs: Yes; Item Phase: In Production; UBX Code: None; Part Number: 180-00024; Revision: 0E; Supplier 1: Digi-Key; Supplier Part Number 1: 1276-3431-1-ND; Manufacturer 2: Hong Kong Resistors Manufactory; Height: 0.4mm; Pins: 2; Power: 1/16W; Voltage: N/A; Manufacturer Part Number 2: RCT0210KFLF; Supplier 2: None; Supplier Part Number 2: None; Max Operating Temp: 155; Min Operating Temp: -55
R42 = UBXH18-0000005: RES THICK FILM CHIP 0402 100K 1% 63mW; Manufacturer: KOA; Manufacturer P/N: RK73H1ETTP1003F; Editor: dario.antonaz; Released by: sandro.sestan; Env: ROHS; Permitted Use: Volume Products; Mfg P/N Status: Active; Mfg P/N Split: 100; Mfg P/N Released: Yes; Part Number: UBXH18-0000005; Tolerance: 1%; Max Power: 63mW; Part Type: Resistor; Release Data: 2009-11-30T11:05:22; UBX Wiki: https://wiki.u-blox.com/bin/view/Operations/PartDetails?index=8114; Perferred: N/A; RefDes: R; Mfg P/N Datasheet: https://wiki.u-blox.com/bin/view/Generic/Docs/DocumentSummary?index=8222; Manufacturer 2: ROHM; Manufacturer P/N 2: MCR01MZPF1003; Mfg P/N Status 2: Obsolete; Mfg P/N Split 2: 0; Mfg P/N Released 2: Yes; Mfg P/N Datasheet 2: https://wiki.u-blox.com/bin/view/Generic/Docs/DocumentSummary?index=8186
R48 = UBXH18-0008121: RES THICK FILM CHIP 0402 1M0 5% 63mW; Manufacturer: KOA; Manufacturer P/N: RK73B1ETTP105J; Editor: daniel.hurni; Released by: doris.zahnd; Env: ROHS; Permitted Use: Volume Products; Perferred: PREF; Mfg P/N Status: Active; Mfg P/N Split: 100; Mfg P/N Released: Yes; Part Number: UBXH18-0008121; Tolerance: 5%; Max Power: 63mW; Min Operating Temp: -55°C; Max Operating Temp: 125°C; Part Type: Resistor; Release Data: 2009-12-01T17:35:03; UBX Wiki: https://wiki.u-blox.com/bin/view/Operations/PartDetails?index=7052; RefDes: R; Mfg P/N Datasheet: https://wiki.u-blox.com/bin/view/Generic/Docs/DocumentSummary?index=4543
R53 R54 = UBXH18-0008049: RES THICK FILM CHIP 0402 1K0 5% 100mW; Manufacturer: YAGEO; Manufacturer P/N: 2322_705_70102_L; Editor: roland.rust; Env: ROHS; Permitted Use: Volume Products; Perferred: PREF; Mfg P/N Status: NRND; Mfg P/N Split: 100; Mfg P/N Released: Yes; Part Number: UBXH18-0008049; Tolerance: 5%; Max Power: 100mW; Part Type: Resistor; Released by: roland.rust; Release Data: 2005-07-22T13:59:44; UBX Wiki: https://wiki.u-blox.com/bin/view/Operations/PartDetails?index=6939; RefDes: R; Manufacturer 2: KOA; Manufacturer P/N 2: RK73B1ETTD102J; Mfg P/N Status 2: NRND; Mfg P/N Split 2: 0; Mfg P/N Released 2: Yes
R55 = UBXH18-0000269: RES THICK FILM CHIP 0402 499R 1% 100mW; Manufacturer: KOA; Manufacturer P/N: RK73H1ETTP4990F; Editor: pierpaolo.arban; Env: ROHS; Permitted Use: Volume Products; Perferred: PREF; Mfg P/N Status: Active; Mfg P/N Split: 100; Mfg P/N Released: No; Part Number: UBXH18-0000269; Tolerance: 1%; Max Power: 100mW; Min Operating Temp: -55°C; Max Operating Temp: 125°C; Part Type: Resistor; UBX Wiki: https://wiki.u-blox.com/bin/view/Operations/PartDetails?index=25384; RefDes: R; Mfg P/N Datasheet: https://wiki.u-blox.com/bin/view/Generic/Docs/DocumentSummary?index=8222
R56 = UBXH18-0008033: RES THICK FILM CHIP 0402 220R 5% 100mW; Manufacturer: ROHM; Manufacturer P/N: MCR01MZPJ221; Editor: roland.rust; Env: ROHS; Permitted Use: Volume Products; Perferred: PREF; Mfg P/N Status: Active; Mfg P/N Split: 100; Mfg P/N Released: Yes; Part Number: UBXH18-0008033; Tolerance: 5%; Max Power: 100mW; Part Type: Resistor; Released by: roland.rust; Release Data: 2009-04-24T14:36:39; UBX Wiki: https://wiki.u-blox.com/bin/view/Operations/PartDetails?index=6914; RefDes: R; Manufacturer 2: KOA; Manufacturer P/N 2: RK73B1ETTP221J; Mfg P/N Status 2: Active; Mfg P/N Split 2: 0; Mfg P/N Released 2: Yes; Manufacturer 3: YAGEO; Manufacturer P/N 3: 2322_705_87221_L; Mfg P/N Status 3: NRND; Mfg P/N Split 3: 0; Mfg P/N Released 3: Yes
RT1 = UBXH18-0000573: THERMISTOR NTC 0201 10K 5% 100mW; Manufacturer: Murata Manufacturing Company, Ltd.; Manufacturer P/N: NCP03XH103J05RL; Editor: eric.moog; Env: ROHS; Permitted Use: Volume Products; Perferred: PREF; Mfg P/N Status: Active; Mfg P/N Split: 100; Mfg P/N Released: No; Part Number: UBXH18-0000573; Tolerance: 5%; Max Power: 100mW; Min Operating Temp: -40°C; Max Operating Temp: 125°C; Part Type: Thermistor; UBX Wiki: https://wiki.u-blox.com/bin/view/Operations/PartDetails?index=39142; RefDes: RT; Mfg P/N Datasheet: https://wiki.u-blox.com/bin/view/Generic/Docs/DocumentSummary?index=8935
SW1 = UBXH19-0000050: 2 WAY ON-ON SUB-MINIATURE SLIDE SWITCH SMD JS SERIES; Manufacturer: C&K Components; Value: JS202011SCQN; Editor: andre.pick; Released by: martin.pilik; Env: ROHS; Permitted Use: Support Products; Perferred: PREF; Mfg P/N Status: Active; Mfg P/N Split: 100; Mfg P/N Released: Yes; Part Number: UBXH19-0000050; Min Operating Temp: -40°C; Max Operating Temp: 85°C; Part Type: Switch; Release Data: 2022-06-09T16:59:15; UBX Wiki: https://wiki.u-blox.com/bin/view/Operations/PartDetails?index=36899; RefDes: S; Mfg P/N Datasheet: https://wiki.u-blox.com/bin/view/Generic/Docs/DocumentSummary?index=16625
TP1-TP9 TP125 TP126 = TP10R: Testpoint, Round 1.0mm Dia; Added By: Jeremy D; Part Number: TP10R; Size: 1.0mm; Height: 0; DNP: DNP; Checked By: Paul B
  TP1: Added Date: 2015-02-01; Checked Date: 2015-02-05
  TP2-TP9 TP125 TP126: Added Date: 2/1/2015; Checked Date: 2/5/2015
U2 = UBXH12-0000459: LOW DROPOUT REGULATOR ON SEMICONDUCTOR NCP691MN33T2G 6DFN 3.3V 6V 1A; Editor: hakan.ekfors; Released by: markus.wejrot; Env: ROHS; Permitted Use: Volume Products; Perferred: PREF; Mfg P/N Status: Active; Mfg P/N Split: 100; Mfg P/N Released: Yes; Part Number: UBXH12-0000459; Value: 3.3V; Max Voltage: 6V; Max Current: 1A; Min Operating Temp: -40°C; Max Operating Temp: 125°C; Part Type: Regulator; Release Data: 2021-08-23 15:14:48.502500; UBX Wiki: https://wiki.u-blox.com/bin/view/Operations/PartDetails?index=35423; RefDes: U; Manufacturer: ON Semiconductor; Manufacturer P/N: NCP691MN33T2G; Mfg P/N Datasheet: https://wiki.u-blox.com/bin/view/Generic/Docs/DocumentSummary?index=35425
U3 = TPS62130ARGTT: Integrated Circuit; Manufacturer_Name: Texas Instruments; Datasheet Link: http://www.ti.com/lit/gpn/tps62130a; Height: 1mm; Manufacturer_Part_Number: TPS62130ARGTT; Mouser Part Number: 595-TPS62130ARGTT; Mouser Price/Stock: https://www.mouser.co.uk/ProductDetail/Texas-Instruments/TPS62130ARGTT?qs=iIeLWXrA%252B1WkTqP1kzAmnQ%3D%3D; Arrow Part Number: TPS62130ARGTT; Arrow Price/Stock: https://www.arrow.com/en/products/tps62130argtt/texas-instruments?region=nac
U4 = UBXH05-0000185: BQ24230 BATTERY CHARGER LI-ION USB 100-500MA 4.2V FLOAT VQFN-16 BQ24230RGTR; Manufacturer 1: Texas Instruments; Body Size: 3.3mm x 3.3mm; Item Phase: Unreleased; SMT Pitch: 0.5mm; Use in new designs: Yes; Voltage: 5-6.5V; UBX Code: None; Editor: eric.moog; Env: ROHS; Permitted Use: Support Products; Perferred: PREF; Mfg P/N Status: Active; Mfg P/N Split: 100; Mfg P/N Released: No; Part Number: UBXH05-0000185; Manufacturer Part Number 1: bq24230; Supplier 1: Digi-key; Supplier Part Number 1: 296-23937-2-ND; Height: 1mm; MFG Package: VQFN-16; Max Operating Temp: 125°C; Min Operating Temp: -40°C; Pins: 16; Revision: None; Size: Other; Manufacturer 2: None; Manufacturer Part Number 2: None; Supplier 2: None; Supplier Part Number 2: None; Value: BQ24230RGTR; Part Type: Digital/Mixed Signal ASIC; Single Source: Yes; UBX Wiki: https://wiki.u-blox.com/bin/view/Operations/PartDetails?index=39077; RefDes: U; Manufacturer: Texas Instruments; Manufacturer P/N: BQ24230RGTR; Mfg P/N Datasheet: https://wiki.u-blox.com/bin/view/Generic/Docs/DocumentSummary?index=39076